# EAGLE design LoraWAN Soil Moisture Sensor v2.0 (EAGLE 6.1)
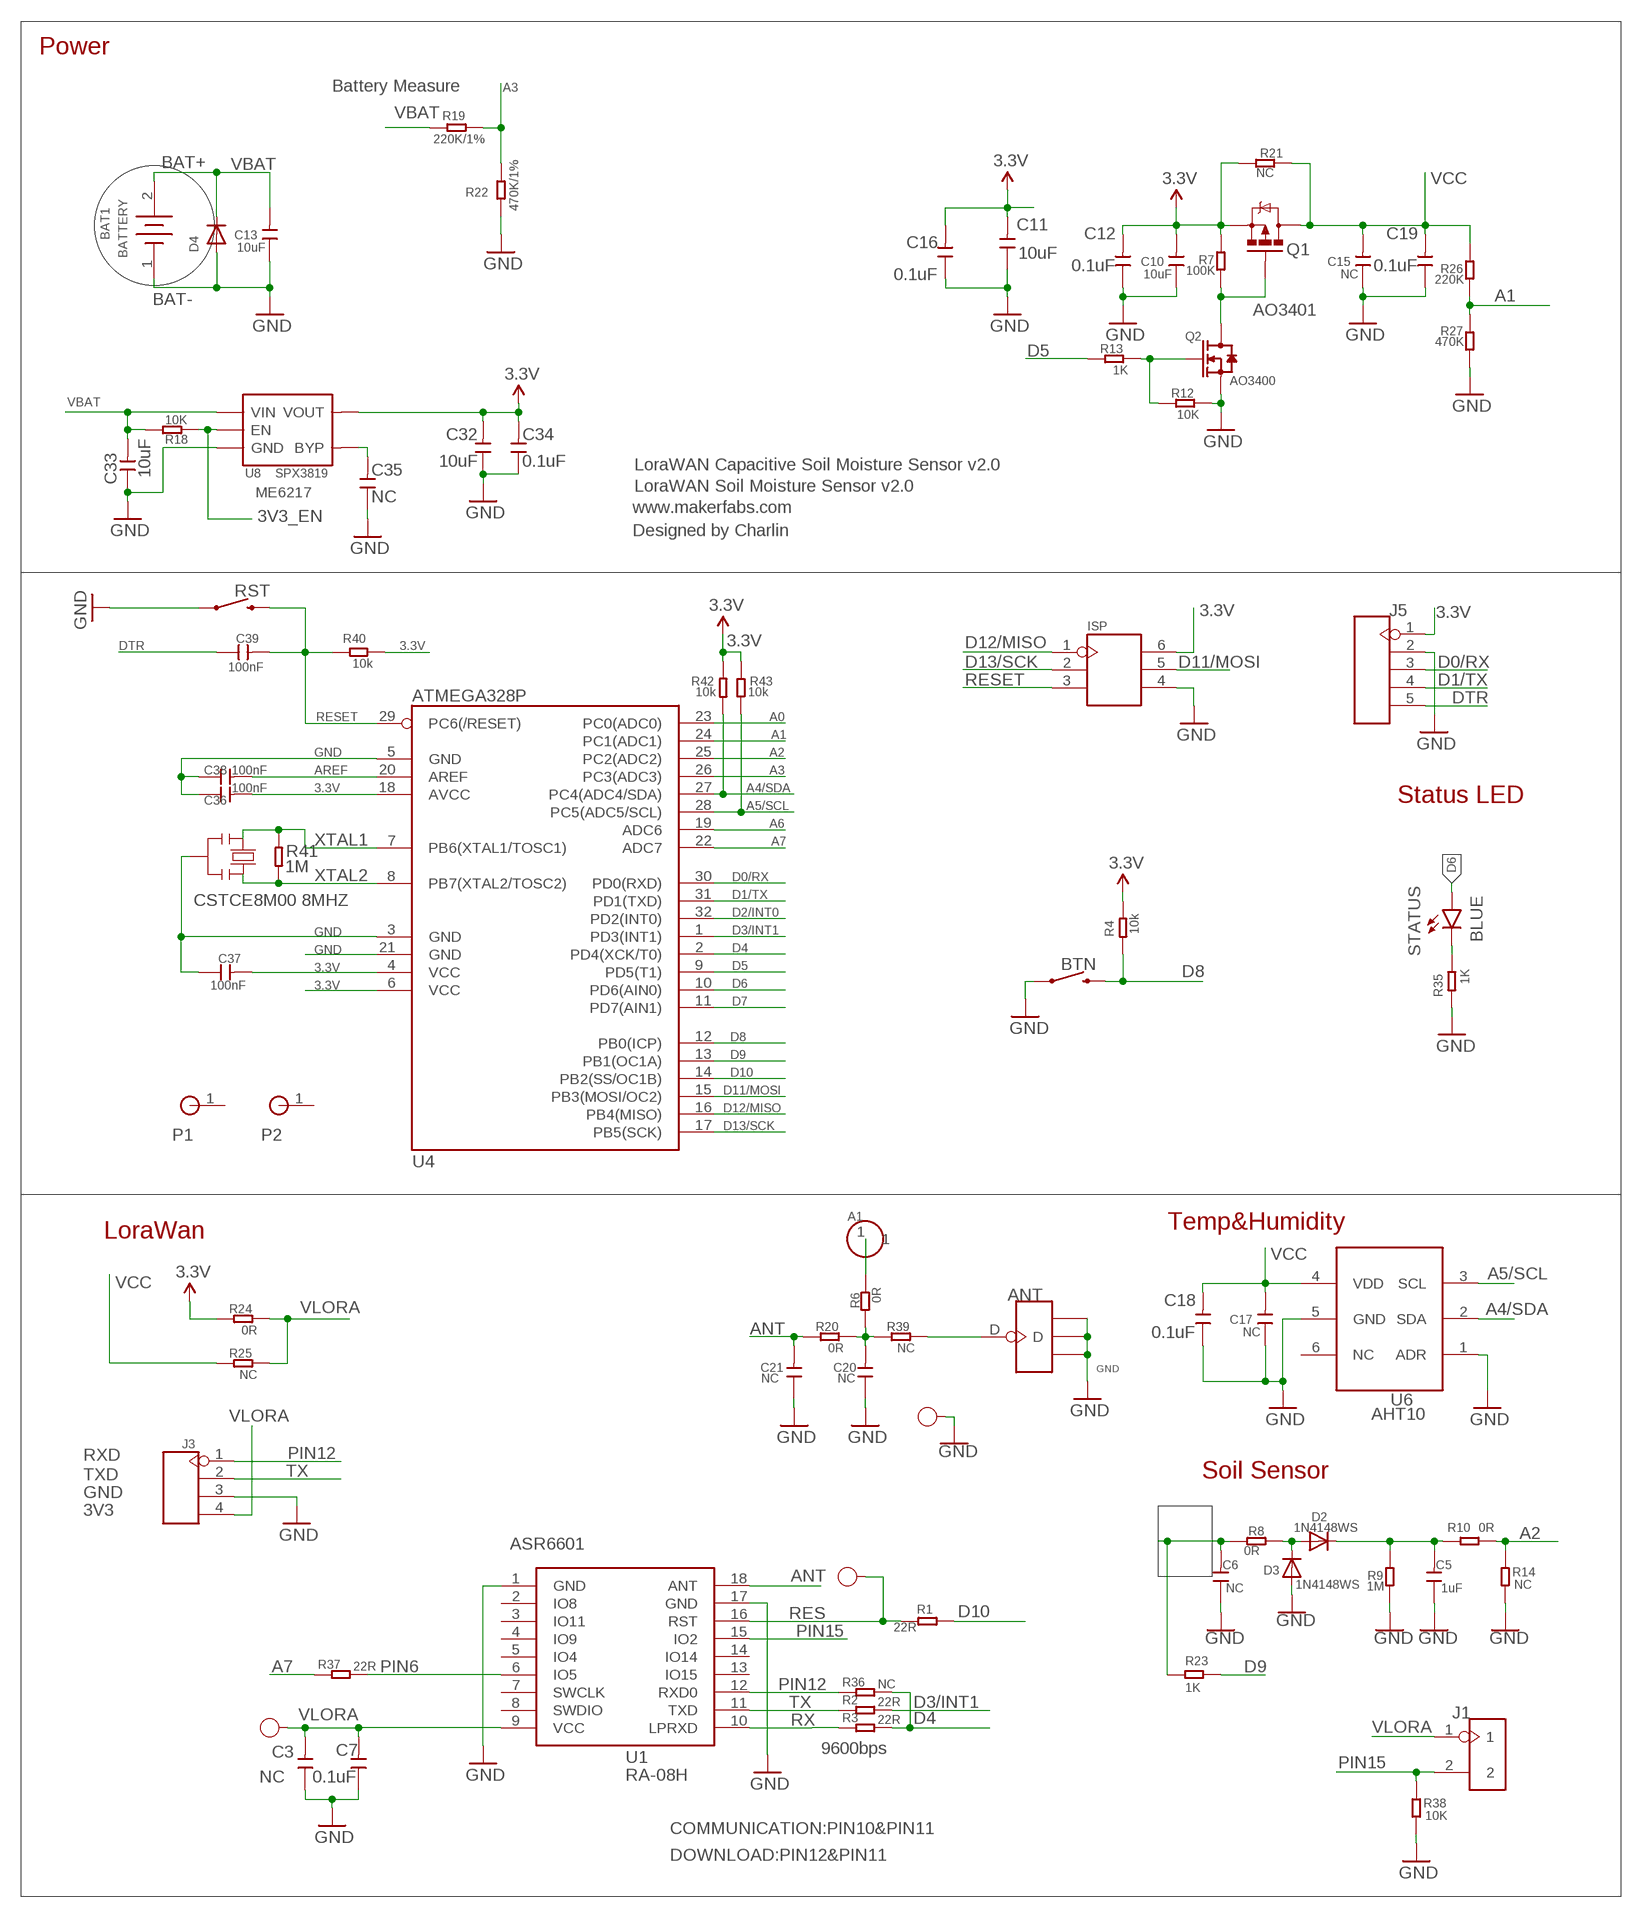
[diagram p0: schematic, sheet 1]

## Parts
3V3  TEST-POINT'4545'  [TP-D45MIL]
A1  HEADER-1P-50  [1P-100/50MIL]
ANT  ANTENNA-U-FL  [4P-U-FL]
BAT1  BATTERY  [BATTERY]
BTN  MOMENTARY-SWITCH-SPST-SMD-6.0X3.5MM  [TACTILE_SWITCH_SMD_6.0X3.5MM]
C3  NC  C-0603  [0603]
C5  1uF  DISCRETE_C-0603  [DISCRETE_C0603]
C6  NC  DISCRETE_C-0603  [DISCRETE_C0603]
C7  0.1uF  C-0603  [0603]
C10  10uF  C-0603  [0603]
C11  10uF  C-0603  [0603]
C12  0.1uF  C-0603  [0603]
C13  10uF  C-0603  [0603]
C15  NC  C-0603  [0603]
C16  0.1uF  C-0603  [0603]
C17  NC  C-0603  [0603]
C18  0.1uF  C-0603  [0603]
C19  0.1uF  C-0603  [0603]
C20  NC  C-0603  [0603]
C21  NC  C-0603  [0603]
C32  10uF  C-0603  [0603]
C33  10uF  C-0603  [0603]
C34  0.1uF  C-0603  [0603]
C35  NC  C-0603  [0603]
C36  100nF  C-0603  [0603]
C37  100nF  C-0603  [0603]
C38  100nF  C-0603  [0603]
C39  100nF  C-0603  [0603]
D2  1N4148WS  DIODESOD-323F  [SOD-323F]
D3  1N4148WS  DIODESOD-323F  [SOD-323F]
D4  DIODESOD-323F  [SOD-323F]
GND  TEST-POINT'4545'  [TP-D45MIL]
ISP  HEADER-2X3P-SMD  [2X3P-2.54-SMD]
J1  HEADER-2P-2.0  [2P-2.0]
J3  HEADER-4P-60/35MILROUND  [4P-65/35ROUND]
J5  HEADER-5P-2.54  [5P-2.54]
P1  HOLE-P1-2.2  [MTGNP1-220-1MM]
P2  HOLE-P1-2.2  [MTGNP1-220-1MM]
Q1  MOSFET-PCHANNEL  [SOT23-3]
Q2  AO3400  DISCRETE_MOSFET-NSOT23  [DISCRETE_SOT23]
R1  22R  R-0603  [R0603]
R2  22R  R-0603  [R0603]
R3  22R  R-0603  [R0603]
R4  10k  R-0603  [R0603]
R6  0R  R-0603  [R0603]
R7  100K  R-0603  [R0603]
R8  0R  R-0603  [R0603]
R9  1M  R-0603  [R0603]
R10  0R  R-0603  [R0603]
R12  10K  R-0603  [R0603]
R13  1K  R-0603  [R0603]
R14  NC  R-0603  [R0603]
R18  10K  R-0603  [R0603]
R19  220K/1%  R-0603  [R0603]
R20  0R  R-0603  [R0603]
R21  NC  R-0603  [R0603]
R22  470K/1%  R-0603  [R0603]
R23  1K  RES-0603  [R0603]
R24  0R  R-0603  [R0603]
R25  NC  R-0603  [R0603]
R26  220K  R-0603  [R0603]
R27  470K  R-0603  [R0603]
R35  1K  R-0603  [R0603]
R36  NC  R-0603  [R0603]
R37  22R  R-0603  [R0603]
R38  10K  R-0603  [R0603]
R39  NC  R-0603  [R0603]
R40  10k  R-0603  [R0603]
R41  1M  R-0603  [R0603]
R42  10k  R-0603  [R0603]
R43  10k  R-0603  [R0603]
RES  TEST-POINT'4545'  [TP-D45MIL]
RST  MOMENTARY-SWITCH-SPST-SMD-6.0X3.5MM  [TACTILE_SWITCH_SMD_6.0X3.5MM]
STATUS  BLUE  LED-BLUE0603  [LED-0603]
U1  RA-08H  [RA-08H]
U4  ATMEGA328P  ATMEGA8/168/328  [TQFP32]
U6  AHT10  [SMD6-127P-400L500W]
U8  SPX3819  [SOT23-5]
Y1  CSTCE8M00 8MHZ  RESONATORMU  [RESONATOR]

## Nets
3.3V: C10.2 C11.2 C12.2 C16.2 C32.2 C34.2 C36.2 C37.2 ISP.6 J5.1 Q1.2(S) R4.1 R7.2 R21.2 R24.2 R40.1 R42.1 R43.1 U4.4(VCC) U4.6(VCC) U4.18(AVCC) U8.5(VOUT)
3V3_EN: R18.2 U8.3(EN)
A0: U4.23(PC0(ADC0))
A1: R26.1 R27.2 U4.24(PC1(ADC1))
A2: R10.2 R14.1 U4.25(PC2(ADC2))
A3: R19.1 R22.2 U4.26(PC3(ADC3))
A4/SDA: R42.2 U4.27(PC4(ADC4/SDA)) U6.2(SDA)
A5/SCL: R43.2 U4.28(PC5(ADC5/SCL)) U6.3(SCL)
A6: U4.19(ADC6)
A7: R37.1 U4.22(ADC7)
ANT: C21.2 R20.2 U1.18(ANT)
AREF: C38.2 U4.20(AREF)
D0/RX: J5.3 U4.30(PD0(RXD))
D1/TX: J5.4 U4.31(PD1(TXD))
D2/INT0: U4.32(PD2(INT0))
D3/INT1: R2.2 U4.1(PD3(INT1))
D4: R3.2 R36.2 U4.2(PD4(XCK/T0))
D5: R13.2 U4.9(PD5(T1))
D6: STATUS.A U4.10(PD6(AIN0))
D7: U4.11(PD7(AIN1))
D8: BTN.2 R4.2 U4.12(PB0(ICP))
D9: R23.2 U4.13(PB1(OC1A))
D10: R1.2 U4.14(PB2(SS/OC1B))
D11/MOSI: ISP.5 U4.15(PB3(MOSI/OC2))
D12/MISO: ISP.1 U4.16(PB4(MISO))
D13/SCK: ISP.2 U4.17(PB5(SCK))
DTR: C39.1 J5.5
GND: ANT.GND1 ANT.GND2 ANT.GND3 BAT1.1 BTN.1 C3.1 C5.1 C6.1 C7.1 C10.1 C11.1 C12.1 C13.1 C15.1 C16.1 C17.1 C18.1 C19.1 C20.1 C21.1 C32.1 C33.1 C34.1 C35.1 C36.1 C37.1 C38.1 D3.A D4.A GND.T ISP.4 J3.3 J5.2 Q2.2(S) R9.1 R12.1 R14.2 R22.1 R27.1 R35.2 R38.2 RST.1 U1.1(GND) U1.17(GND) U4.3(GND) U4.5(GND) U4.21(GND) U6.1(ADR) U6.5(GND) U8.2(GND) Y1.2
N$1: ANT.D R39.1
N$5: C6.2 R8.1 R23.1
N$6: A1.1 R6.1
N$8: Q1.1(G) Q2.3(D) R7.1
N$9: D2.A D3.C R8.2
N$10: Q2.1(G) R12.2 R13.1
N$11: C5.2 D2.C R9.2 R10.1
N$12: C20.2 R6.2 R20.1 R39.2
N$16: C35.2 U8.4(BYP)
N$19: R35.1 STATUS.C
PIN6: R37.2 U1.6(IO5)
PIN12: J3.1 R36.1 U1.12(RXD0)
PIN15: J1.2 R38.1 U1.15(IO2)
RES: R1.1 RES.T U1.16(RST)
RESET: C39.2 ISP.3 R40.2 RST.2 U4.29(PC6(/RESET))
RX: R3.1 U1.10(LPRXD)
TX: J3.2 R2.1 U1.11(TXD)
VBAT: BAT1.2 C13.2 C33.2 D4.C R18.1 R19.2 U8.1(VIN)
VCC: C15.2 C17.2 C18.2 C19.2 Q1.3(D) R21.1 R25.2 R26.2 U6.4(VDD)
VLORA: 3V3.T C3.2 C7.2 J1.1 J3.4 R24.1 R25.1 U1.9(VCC)
XTAL1: R41.2 U4.7(PB6(XTAL1/TOSC1)) Y1.1
XTAL2: R41.1 U4.8(PB7(XTAL2/TOSC2)) Y1.3
Unconnected: P1.1 P2.1 U1.2(IO8) U1.3(IO11) U1.4(IO9) U1.5(IO4) U1.7(SWCLK) U1.8(SWDIO) U1.13(IO15) U1.14(IO14) U6.6(NC)

## Notes on the sheet
- Power
- Battery Measure
- BAT+
- BAT-
- AO3401
- LoraWAN Capacitive Soil Moisture Sensor v2.0
- LoraWAN Soil Moisture Sensor v2.0
- ME6217
- www.makerfabs.com
- Designed by Charlin
- Status LED
- Temp&Humidity
- LoraWan
- RXD
- Soil Sensor
- TXD
- GND
- 3V3
- ASR6601
- 9600bps
- COMMUNICATION:PIN10&PIN11
- DOWNLOAD:PIN12&PIN11

## Library data of the parts
3V3 GND RES = Discrete-new:TEST-POINT; PARTNO: DNP
A1 = Connector:HEADER-1P
ANT = Connector:ANTENNA-U-FL
BAT1 = sale:BATTERY
BTN RST = SparkFun-Switches:MOMENTARY-SWITCH-SPST: Momentary Switch (Pushbutton) - SPST Normally-open (NO) SPST momentary switches (buttons, pushbuttons). Variants PTH-12MM - 12mm square, through-hole Momentary Pushbutton Switch - 12mm Square <https://www.sparkfun.com/products/9190> (COM-09190) PTH-6.0MM, PTH-6.0MM-KIT - 6.0mm square, through-hole Mini Pushbutton Switch <https://www.sparkfun.com/products/97> (COM-00097) KIT package intended for soldering kit's - only one side of pads' copper is exposed. PTH-RIGHT-ANGLE-KIT - Right-angle, through-hole Right Angle Tactile Button <https://www.sparkfun.com/products/10791> - Used on SparkFun BigTime Watch Kit <https://www.sparkfun.com/products/11734> SMD-12MM - 12mm square, surface-mount Tactile Button - SMD (12mm) <https://www.sparkfun.com/products/12993> (COM-12993) Used on SparkFun PicoBoard <https://www.sparkfun.com/products/11888> SMD-4.5MM - 4.5mm Square Trackball Switch Used on SparkFun Blackberry Trackballer Breakout <https://www.sparkfun.com/products/13169> SMD-4.6MMX2.8MM - 4.60mm x 2.80mm, surface mount Used on SparkFun SAMD21 Mini Breakout <https://www.sparkfun.com/products/13664> SMD-5.2MM, SMD-5.2-REDUNDANT - 5.2mm square, surface-mount Mini Pushbutton Switch - SMD <https://www.sparkfun.com/products/8720> (COM-08720) Used on Arduino Pro Mini <https://www.sparkfun.com/products/11114> REDUNDANT package connects both switch circuits together SMD-6.0X3.5MM - 6.0 x 3.5mm, surface mount Momentary Reset Switch SMD <https://www.sparkfun.com/products/8229> (COM-08229) SMD-6.2MM-TALL - 6.2mm square, surface mount Tactile Button - SMD (6mm) <https://www.sparkfun.com/products/12992> Used on SparkFun Digital Sandbox <https://www.sparkfun.com/products/12651> SMD-RIGHT-ANGLE - Right-angle, surface mount Used on SparkFun Block for Intel® Edison - Arduino <https://www.sparkfun.com/products/13036>; PROD_ID: SWCH-00815; SF_SKU: COM-08229
C3 C7 C10-C13 C15-C21 C32-C39 = Discrete:C*: Ceramic Capacitors
C5 C6 = A9G:DISCRETE_C*: Ceramic Capacitors
D2-D4 = adafruit2:DIODE: Diode SMADIODE - SMA Surface Mount Package 20V 1A Schottky Diode Digikey: 641-1014-6-ND DO-1N4148 - Through Hole Small Current Diode SOD-123 20V 1 A (.5mV Vf) Schottky Diode - Digikey: MBRX120TPMSCT-ND SOD-323 10V 570mA (.38mV Vf, 3ns) Schottky Diode - Digikey: ZLLS410CT-ND SOD-523 30V 30mA Schottky Diode (RB751S-40TE61) - Digikey: RB751S-40TE61CT-ND SOT23-R/W - SOT23 Package (R = Solder Paste/Reflow Ovens, W = Hand-Soldering) BAT54Film 40V 300mA - Digikey: 497-7162-1-ND
ISP = Connector:HEADER-2X3P
J1 = Connector:HEADER-2P
J3 = Connector:HEADER-4P
J5 = Connector:HEADER-5P
P1 P2 = self:HOLE-P1-2.2
Q1 = User-Submitted:MOSFET-PCHANNEL: Generic PMOSFET IRLML2244 - TRANS-11153 (SOT-23 -20V -4.3A) (1.Gate 2.Source 3.Drain) FQP27P06 - COM-10349 <http://www.sparkfun.com/products/10349> (TO-220 -60V -27A) (1.Gate 2.Source 3.Drain); PROD_ID: TRANS-08285
Q2 = A9G:DISCRETE_MOSFET-N: IRLL014: http://www.vishay.com/docs/91319/sihll014.pdf
R1-R4 R6-R10 R12-R14 R18-R22 R24-R27 R35-R43 = Discrete:R*
R23 = Discrete-new:RES
STATUS = SparkFun-LED:LED-BLUE: Blue SMD LED Used in manufacturing of various products at SparkFun Packages: 0603 - SMD 0603 package [Product Link] <http://www.digikey.com/product-detail/en/SMLE12BC7TT86/511-1589-2-ND/1641808> 1206 - SMD1206 package [Product Link] <http://www.digikey.com/product-detail/en/lite-on-inc/LTST-C150TBKT/160-1643-1-ND/573584> SparkFun Products: ESP8266 Thing-Dev Board <https://www.sparkfun.com/products/13711> RedBoard <https://www.sparkfun.com/products/12757>; PROD_ID: DIO-08575
U1 = sale:RA-08H
U4 = IC:ATMEGA8/168/328: MICROCONTROLLER
U6 = self:AHT10
U8 = IC:SPX3819
Y1 = SmartPrj:RESONATOR

## Net classes
0 default: width 0.152 mm, drill 0.305 mm, clearance 0.152 mm
2 Clock: width 0.089 mm, clearance 0.178 mm

## Board
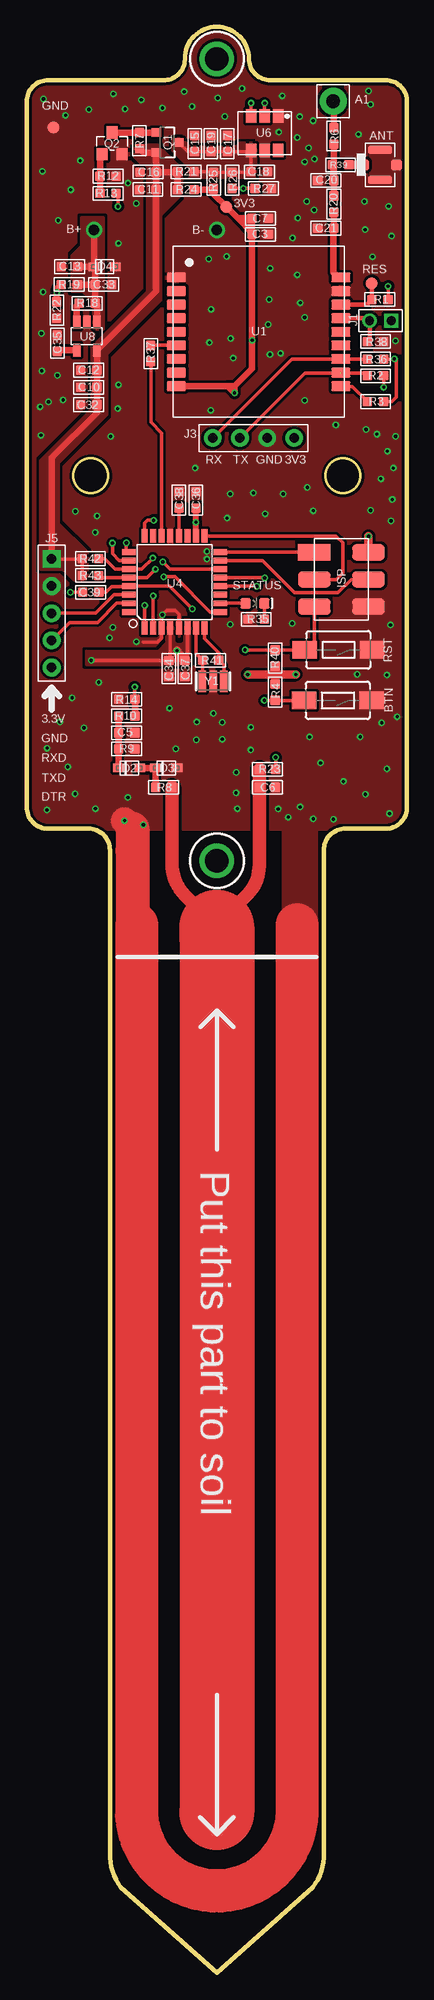
[diagram p1: board, top side]
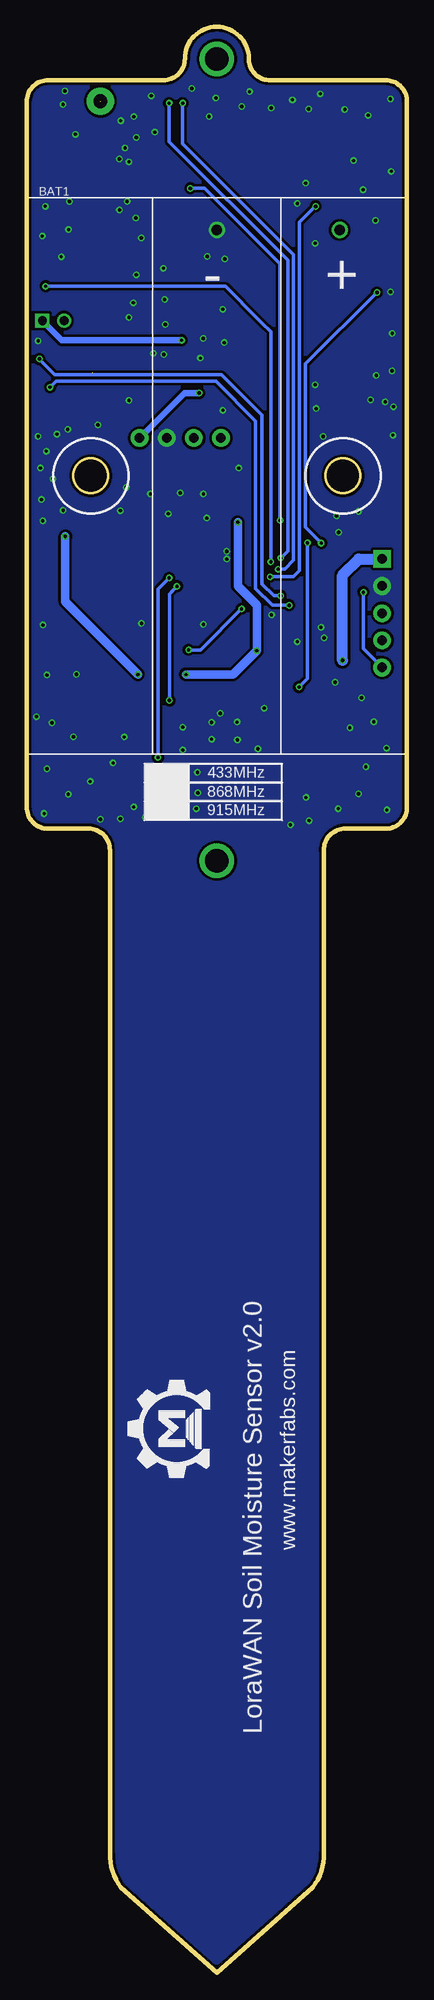
[diagram p2: board, bottom side, seen from below]

Size 35.6 x 182 mm. Coordinates in mm from the lower left corner, seen from the top.
Outline: 17.8,0 8.8,8 arc-38 7.79,11.18 7.79,105 arc90 5.79,107 2,107 arc-90 0,109 0,175 arc-90 2,177 12.8,177 arc90 14.8,178.89 14.8,179 arc-180 20.8,179 arc90 22.8,177 33.6,177 arc-90 35.6,175 35.6,109 arc-90 33.6,107 29.81,107 arc90 27.81,105 27.81,11.18 arc-38 26.8,8 17.8,0
Outline: circle at 6,140 radius 1.6
Outline: circle at 29.6,140 radius 1.6
Copper layers (1*16): Top 0.035mm / dielectric 1.5mm / Bottom 0.035mm
Design rules: minimum track width 8mil, minimum drill 12mil, track to track 6mil, track to pad 6mil, pad to pad 6mil, via to via 6mil, smd to smd 0mil, copper to edge 10mil, drill to drill 10mil, minimum pad ring 10mil, minimum via ring 6mil, stop-mask expansion 4mil, vias tented up to drill 100mil, thermal gap 0mil

### Footprints (pad centres in the part's own frame; a part is rotated, then mirrored left to right if it is on the bottom)
TP-D45MIL = smd 1.143 x 1.143: T 0,0
1P-100/50MIL = drill 1.27 pad 2.54: 1 0,0
4P-U-FL = smd 1.016 x 1.016: D -1.524,0; GND3 1.524,0 | smd 2.286 x 0.762: GND1 0,1.397; GND2 0,-1.397
BATTERY = drill 1: 1 -23,0; 2 -23,11.5
TACTILE_SWITCH_SMD_6.0X3.5MM = smd 2.3 x 1.6: 1 -3.15,0; 2 3.15,0
0603 = smd 0.889 x 0.889: 1 -0.762,0; 2 0.762,0
DISCRETE_C0603 = smd 0.889 x 0.889: 1 -0.762,0; 2 0.762,0
SOD-323F = smd 1 x 0.8: A -1,0; C 1,0
2X3P-2.54-SMD = smd 3.048 x 1.524: 1 -2.54,2.54; 2 -2.54,0; 3 -2.54,-2.54; 4 2.54,-2.54; 5 2.54,0; 6 2.54,2.54
2P-2.0 = drill 0.813 pad 1.27 square: 1 -1.016,0 | drill 0.813 pad 1.27: 2 1.016,0
4P-65/35ROUND = drill 0.889 pad 1.651: 1 0,3.81; 2 0,1.27; 3 0,-1.27; 4 0,-3.81
5P-2.54 = drill 0.889 pad 1.651 square: 1 0,5.08 | drill 0.889 pad 1.651: 2 0,2.54; 3 0,0; 4 0,-2.54; 5 0,-5.08
MTGNP1-220-1MM = drill 2.2: 1 0,0
SOT23-3 = smd 0.8 x 0.9: 1 -0.95,-1; 2 0.95,-1; 3 0,1.1
DISCRETE_SOT23 = smd 1.016 x 1.143: 1 -0.95,-1.016; 2 0.95,-1.016; 3 0,1.016
R0603 = smd 0.889 x 0.889: 1 -0.762,0; 2 0.762,0
R0603' = smd 0.889 x 0.889: 1 0,0.762; 2 0,-0.762
LED-0603 = smd 1 x 1: A -0.877,0; C 0.877,0
RA-08H = smd 1.8 x 0.91: 1 -7.7,5.08; 2 -7.7,3.81; 3 -7.7,2.54; 4 -7.7,1.27; 5 -7.7,0; 6 -7.7,-1.27; 7 -7.7,-2.54; 8 -7.7,-3.81; 9 -7.7,-5.08; 10 7.7,-5.08; 11 7.7,-3.81; 12 7.7,-2.54; 13 7.7,-1.27; 14 7.7,0; 15 7.7,1.27; 16 7.7,2.54; 17 7.7,3.81; 18 7.7,5.08
TQFP32 = smd 1.27 x 0.559: 1 -4.293,2.8; 2 -4.293,2; 3 -4.293,1.2; 4 -4.293,0.4; 5 -4.293,-0.4; 6 -4.293,-1.2; 7 -4.293,-2; 8 -4.293,-2.8; 17 4.293,-2.8; 18 4.293,-2; 19 4.293,-1.2; 20 4.293,-0.4; 21 4.293,0.4; 22 4.293,1.2; 23 4.293,2; 24 4.293,2.8 | smd 0.559 x 1.27: 9 -2.8,-4.293; 10 -2,-4.293; 11 -1.2,-4.293; 12 -0.4,-4.293; 13 0.4,-4.293; 14 1.2,-4.293; 15 2,-4.293; 16 2.8,-4.293; 25 2.8,4.293; 26 2,4.293; 27 1.2,4.293; 28 0.4,4.293; 29 -0.4,4.293; 30 -1.2,4.293; 31 -2,4.293; 32 -2.8,4.293
SMD6-127P-400L500W = smd 1.27 x 1: 1 -1.6,1.27; 2 -1.6,0; 3 -1.6,-1.27; 4 1.6,-1.27; 5 1.6,0; 6 1.6,1.27
SOT23-5 = smd 0.69 x 1.2: 1 -0.95,-1.3; 2 0,-1.3; 3 0.95,-1.3; 4 0.95,1.3; 5 -0.95,1.3
RESONATOR = smd 0.7 x 2: 1 -1,0; 2 0,0; 3 1,0

### Placement (x,y rotation side)
3V3  18.69,165.15 90 top
A1  28.7,175.03 0 top
ANT  33.08,169.09 0 top
BAT1  17.8,140 270 bottom
BTN  29.13,119 180 top
C3  21.86,162.59 180 top
C5  9.36,115.97 180 top
C6  22.54,110.87 180 top
C7  21.86,164.08 180 top
C10  5.81,148.29 0 top
C11  11.34,166.77 0 top
C12  5.81,149.89 0 top
C13  4,159.56 0 top
C15  15.72,171.07 270 top
C16  11.36,168.41 0 top
C17  18.79,171.07 270 top
C18  21.77,168.44 180 top
C19  17.24,171.07 270 top
C20  27.99,167.63 0 top
C21  27.99,163.16 0 top
C32  5.81,146.66 0 top
C33  7.18,157.89 180 top
C34  13.3,121.97 90 top
C35  2.86,152.4 270 top
C36  15.84,137.74 270 top
C37  14.8,121.97 90 top
C38  14.24,137.74 270 top
C39  5.99,129.11 0 top
D2  9.6,112.68 180 top
D3  13.06,112.68 180 top
D4  7.3,159.56 180 top
GND  2.51,172.59 90 top
ISP  29.46,130.3 0 top
J1  33.12,154.51 180 top
J3  21.23,143.54 90 top
J5  2.33,127.15 0 top
P1  17.8,104 0 top
P2  17.8,179 0 top
Q1  13.13,171.17 270 top
Q2  8,171.09 0 top
R1  33.07,156.49 0 top
R2  32.66,149.35 0 top
R3  32.66,146.94 0 top
R4  23.26,119.76 270 top
R6  28.75,171.78 270 top
R7  10.56,171.35 270 top
R8  12.82,110.87 180 top
R9  9.36,114.45 180 top
R10  9.36,117.55 0 top
R12  7.61,168.02 180 top
R13  7.61,166.42 0 top
R14  9.36,119.11 180 top
R18  5.66,156.13 180 top
R19  3.98,157.89 0 top
R20  28.76,165.41 270 top
R21  14.9,168.43 180 top
R22  2.81,155.5 90 top
R23  1K  [R0603']  22.55,112.55 90 top
R24  14.9,166.77 180 top
R25  17.5,167.64 90 top
R26  19.22,167.64 90 top
R27  22.14,166.88 180 top
R35  21.48,126.59 180 top
R36  32.66,150.93 0 top
R37  11.6,151.43 90 top
R38  32.66,152.55 0 top
R39  29.38,169.09 180 top
R40  23.26,122.96 90 top
R41  17.22,122.76 180 top
R42  5.96,132.26 0 top
R43  5.96,130.68 0 top
RES  32.3,158.01 90 top
RST  29.18,123.72 180 top
STATUS  21.36,128.07 0 top
U1  21.71,153.47 0 top
U4  13.84,130.07 90 top
U6  22.27,172.04 270 top
U8  5.63,153.06 180 top
U$7  [MAKERFABS_0.3]  18.5,46.76 90 bottom
Y1  17.44,120.78 0 top

### Tracks (layer width: path | path; a pad name or v marks a point on that pad's centre or on a via)
3.3V  (via drill 0.3)
  Top 0.305: J5.1 5.23,132.23 5.23,132.28 | R43.1 R42.1 | C36.2 | C34.2 v6.04,122.73 | U4.4 13.44,122.87 C34.2 | U4.6 15.04,122.97 C37.2 C34.2 | U4.18 v15.84,135.66
  Top 0.546: U4.18 C36.2
  Top 0.61: J5.1 2.33,141.68 6.57,145.92 C32.2 C10.2 C12.2 6.58,149.9 U8.5 12.1,157.28 C11.2 12.12,166.79 C16.2 | R7.2 10.93,170.22 Q1.2 C16.2 | C16.2 14.13,168.41 R21.2 R24.2
  Top 0.813: R4.1 23.26,121.44 | 23.26,121.44 R40.1 | v32,134.34 ISP.6 | C37.2 14.07,123.47 v14.07,123.65 | v20.7,121.41 v25.19,121.41 23.29,121.41 23.26,121.44
  Bottom 0.305: 3.91,132.23 J5.1
  Bottom 0.813: v15.84,135.66 15.84,129.69 14.07,127.91 v14.07,123.65 16.3,121.41 v20.7,121.41 | v25.19,121.41 32,128.22 v32,134.34
  Bottom 1.016: v6.04,122.73 6.04,130.71 4.52,132.23 J5.1
  pour Top: 10.08,170.92 12.26,170.92 14.5,168.68 14.5,166.32 12.54,164.36 12.54,156.44 7.49,151.38 7.49,145.72 2.97,141.2 2.97,135.53 5.66,132.84 5.66,130.3 4.39,130.3 3.4,131.29 1.29,131.29 1.29,141.4 6.12,146.23 6.12,152.04 11.3,157.23 11.3,168.66 10.15,169.8 10.08,169.88
  pour Top: 13.15,126.49 13.15,124.38 12.34,123.57 5.63,123.57 5.61,123.6 5.61,122.35 15.23,122.35 15.23,126.52 14.8,126.52 14.8,124.51 14.52,124.23 14.02,124.23 13.74,124.51 13.74,126.49
3V3_EN
  Top 0.61: U8.3 4.68,155.92 R18.2
A1  (via drill 0.3)
  Top 0.305: U4.24 11.04,135.58 11.3,135.84 v11.88,135.84 | R27.2 v20.29,166.88 R26.1
  Bottom 0.305: v20.29,166.88 18.94,166.88 11.88,159.82 v11.88,135.84
A2  (via drill 0.3)
  Top 0.305: v10.1,120.24 10.1,119.13 R14.1 | U4.25 9.32,133.1 v9.32,133.73
  Top 0.61: R10.2 R14.1 | R14.1
  Bottom 0.305: 9.54,120.8 v10.1,120.24 9.32,121.03 v9.32,133.73
A3  (via drill 0.3 pad 0.3)
  Top 0.305: U4.26 8.66,132.07 8.02,132.72 v8.02,133.71
  Top 0.61: R22.2 v2.81,157.15 2.81,157.48 R19.1
  Bottom 0.305: v8.02,133.71 9.49,135.18 9.49,150.47 v2.81,157.15
A4/SDA  (via drill 0.3)
  Top 0.305: R42.2 7.28,132.26 8.27,131.27 U4.27 10.77,131.27 v11.81,132.31 | U6.2 v22.27,174.85
  Bottom 0.305: v22.27,174.85 22.27,171.25 11.17,160.15 11.17,132.94 v11.81,132.31
A5/SCL  (via drill 0.3)
  Top 0.305: R43.2 6.73,130.47 U4.28 11.27,130.48 v12.06,131.27 | U6.3 v21,174.85
  Bottom 0.305: v21,174.85 21,171.07 10.61,160.68 10.61,132.1 11.45,131.27 v12.06,131.27
A7
  Top 0.305: U4.22 12.64,144 11.63,145.01 11.63,150.65 R37.1
ANT
  Top 0.61: R20.2 C21.2 28.72,163.16 28.72,158.98 28.75,158.98 29.18,158.55 U1.18 | U1.18 29.43,158.55 29.54,158.65 29.46,158.65 29.38,158.57 29.39,158.57 U1.18
AREF
  Top 0.305: U4.20 C38.2
D0/RX
  Top 0.305: U4.30 8.19,128.87 6.47,127.15 J5.3
D1/TX
  Top 0.305: U4.31 8.43,128.07 6.65,126.29 4.01,126.29 J5.4
D3/INT1  (via drill 0.3)
  Top 0.305: R2.2 v33.42,148.28 | v11.04,127.89 U4.1
  Bottom 0.305: v11.04,127.89 12.59,127.89 14.17,129.46 14.17,145.14 17.88,148.84 32.86,148.84 v33.42,148.28
D4  (via drill 0.3)
  Top 0.305: R36.2 v34.41,150.93 34.59,150.75 34.59,147.37 34.16,146.94 R3.2 | U4.2 v11.84,128.77 v11.83,128.78
  Bottom 0.305: v34.41,150.93 32.96,149.48 17.37,149.48 14.61,146.72 14.45,146.56 13.58,145.69 13.58,129.9 12.47,128.78 v11.83,128.78
D5  (via drill 0.3)
  Top 0.305: U4.9 17.17,127.27 13.89,130.56 v12.82,130.56 | R13.2 8.55,166.24 v8.55,165.2
  Bottom 0.305: v12.82,130.56 10.61,130.56 10.05,131.12 10.05,163.7 v8.55,165.2
D6
  Top 0.305: U4.10 STATUS.A
D8  (via drill 0.3)
  Top 0.305: BTN.2 R4.2 v22.25,119 | U4.12 v21.53,129.67
  Bottom 0.305: 22.04,129.16 v21.53,129.67 22.25,128.96 v22.25,119
D9  (via drill 0.3)
  Top 0.305: U4.13 22.25,130.47 v22.27,130.45 | v23.31,113.67 v23.31,113.66 R23.2
  Bottom 0.305: v22.27,130.45 23.31,129.41 v23.31,113.67
D10  (via drill 0.3)
  Top 0.305: v33.83,157.73 R1.2 | U4.14 13.43,131.27 v12.75,131.95
  Bottom 0.305: v33.83,157.73 17.01,157.73 13.9,154.62 13.61,154.33 12.75,153.47 v12.75,131.95
D11/MOSI
  Top 0.305: U4.15 22.05,132.07 25.06,129.06 29.13,129.06 30.37,130.3 ISP.5
D12/MISO
  Top 0.305: U4.16 26.89,132.87 ISP.1
D13/SCK
  Top 0.305: U4.17 28.95,134.37 29.59,133.73 29.59,130.89 29,130.3 ISP.2
DTR  (via drill 0.3)
  Top 0.305: v4.08,129.11 C39.1
  Bottom 0.305: J5.5 4.08,123.83 v4.08,129.11
GND  (via drill 0.3 pad 0.15)
  Top 0.305: 10.89,124.46 12.26,124.46 12.64,124.83 U4.3 12.64,126.94 12.7,127 | U4.5 14.24,127.08 13.91,127.41 13.08,127.41 v12.68,127.01
  Top 2.54: v9.15,107.75 9.9,107.01 | 10.3,98 9.9,98.4 9.9,104.93
  Top 3.2: 9.9,107.01 9.9,104.93 9.9,96.5
  Top 4: 10.3,98 10.3,15.03 arc178 25.3,15.03 25.3,98
  other vias: 15.87,115.31 6.44,108.87 19.59,110.34 23.53,108.85 28.71,107.88 7.86,143.69 19.62,112.28 24.85,126.19 6.59,136.25 17.23,146.13 17.48,117.79 26.02,169.37 19.34,151.01 18.7,160.51 19.08,152.84 8.11,175.72 25.38,164.12 23.94,175.55 17.1,152.46 20.15,176.23 31.05,171.94 25.33,171.63 24.88,162.24 32.19,174.73 26.81,173.21 26.4,170.67 26.93,169.63 32.01,176 31.68,163.02 26.2,165.67 26.02,154.82 1.25,146.46 32.19,136.76 26.83,136.74 5.83,174.25 25.56,173.59 17.05,160.28 18.75,136.05 4.12,166.76 15.91,116.97 18.3,116.95 10.27,124.49 30.95,121.44 19.06,126.12 4.53,110.27 6.41,134.7 26.83,107.93 25.59,109.02 31.23,115.6 19.72,108.87 9.46,109.91 18.3,115.37 10.91,107.37 24.49,108.08 26.02,147.05 22.62,154.16 17.26,155.58 25.33,158.81 22.79,159.42 23.76,151.47 14.74,175.93 31.61,165.67 26.91,164.85 22.69,156.5 22.34,136.46 25.61,156.19 32.37,160.48 33.16,139.73 1.89,108.74 34.22,137.78 1.48,168.49 3.64,173.72 10.73,175.17 9.2,174.3 15.48,174.53 5.01,169.48 1.56,175.24 24.01,138.31 1.38,153.32 4.56,136.68 1.53,157.21 34.32,140.72 32.78,143.9 28.94,144.76 34.1,135.8 34.68,117.48 34.53,143.69 2.04,146.92 5.34,116.44 1.91,114.54 3.84,112.78 13.95,114.46 20.99,114.36 20.99,116.49 26.48,115.58 31.71,110.22 29.65,111.41 33.23,116.9 21.22,138.41 33.77,142.3 31.76,144.33 2.96,163.89 3.11,117 7.76,124.85 6.74,120.68 4.25,119.23 8.06,125.84 16.87,132.93 15.76,140.72 19.06,138.31 26.27,138.92 22.77,151.37 34.53,152.61 23.61,172.14 18.53,173.62 17.89,175.34 12.71,174.4 9.48,167.37 10.27,165.46 8.59,161.75 33.87,165.21 34.15,162.41 2.88,149.38 3.41,147.1 1.33,143.8 1.41,149.82 13.37,118.27 16.87,132.21 34.07,126.04 33.72,121.37 33.72,112.61 33.97,108.41 27.52,113.14 8.59,148.52 8.52,146.29
  pour Top (isolate 0.254, rank 6): -7.6,200 -8.16,107 40.61,107 41.17,200
  pour Bottom (isolate 0.254, rank 6): -8.19,200 -8.11,0 40.65,0 40.58,200
  pour Top: 27.05,107.21 27.17,107.21 27.17,93.55 23.44,93.55 23.44,98.09 24,98.65 24,106.91 24,107.21
N$1
  Top 0.813: R39.1 ANT.D
N$5
  Top 1.27: R8.1 13.58,103.76 arc45 14.83,100.76 17.8,97.79 17.8,97.51 | 17.8,96.85 17.8,98 20.66,100.86 arc45 21.77,103.54 C6.2 21.77,112.54 R23.1
  Top 7: 17.8,97.8 17.8,97.51 17.8,96.85 17.8,15
N$6  (1 unrouted)
  Top 0.61: R6.1 28.75,175.01 28.72,175.03
N$8
  Top 0.61: Q2.3 R7.1 12.12,172.11 Q1.1
N$9
  Top 0.61: R8.2 D3.C D2.A
N$10
  Top 0.61: Q2.1 6.85,169.88 R12.2 R13.1
N$11
  Top 0.61: D2.C R9.2 C5.2 R10.1 | R10.1
N$12
  Top 0.406: R39.2 28.62,167.76 C20.2
  Top 0.61: R20.1 C20.2 28.75,169.09 R6.2 28.77,170.8
N$16
  Top 0.61: U8.4 2.99,151.76 C35.2
N$19
  Top 0.305: R35.1 22.25,128.06 STATUS.C
PIN6
  Top 0.305: U1.6 R37.2
PIN12
  Top 0.305: R36.1 U1.12 24.81,150.93 J3.1
PIN15
  Top 0.406: U1.15 31.87,154.74 J1.2 32.1,152.76 R38.1
RES
  Top 0.406: U1.16 31.82,156.01 R1.1 RES.T
RESET  (via drill 0.3)
  Top 0.305: C39.2 7.41,129.11 7.95,129.64 9.51,129.64 U4.29 13.37,129.67 v15.49,127.56 | ISP.3 26.92,124.61 RST.2 R40.2 v20.44,123.72
  Bottom 0.305: v15.49,127.56 19.32,123.72 v20.44,123.72
RX
  Top 0.305: R3.1 31.9,146.96 30.5,148.36 29.44,148.36 U1.10
TX  (1 unrouted)
  Top 0.305: J3.2 26.03,149.61 29.41,149.61 | 29.41,149.61 29.43,149.63 | 29.41,149.61 31.64,149.61 R2.1
VBAT
  Top 0.61: BAT1.2 D4.C | C33.2 6.42,159.43 D4.C | C13.2 D4.C | R19.2 C33.2 | C33.2 R18.1 6.58,155.97 U8.1
  pour Top: 6.24,153.72 6.24,156.26 5.23,157.28 4.26,157.28 4.26,160.6 5.13,161.47 5.13,164.16 7.16,164.16 7.16,153.77 7.16,153.72
VCC
  Top 0.305: Q1.3 15.09,170.31 C15.2 C19.2 C17.2 20.87,170.3 U6.4 C18.2 20.97,168.4 R26.2 R25.2 17.47,168.43 R21.1
  pour Top: 21.43,171.09 21.43,167.94 15.21,167.94 15.21,168.91 13.71,170.41 13.71,171.53 14.5,171.53 15.29,170.74 19.58,170.74 19.96,171.12 21.43,171.12
VLORA  (via drill 0.3 pad 0.15, 0.3 pad 0.3)
  Top 0.61: U1.9 18.82,148.39 | 18.82,148.39 19.45,148.39 | 19.45,148.39 21.1,150.04 v21.1,152.68 C3.2 | C3.2 21.1,162.74 19.76,164.08 | 17.5,166.34 3V3.T 19.76,164.08 | 17.5,166.34 R25.1 | R24.1 17.07,166.77 17.5,166.34 | C7.2 20.59,164.08 | 20.59,164.08 19.76,164.08 | C3.2 21.1,163.58 20.59,164.08 | v19.45,147.75 19.45,148.39 | 18.82,148.39 v19.45,147.75 | v19.45,147.75 19.38,147.83 19.38,148.08
  Bottom 0.61: J1.1 32.3,152.68 v21.1,152.68 | J3.4 20.82,147.75 v19.45,147.75
XTAL1
  Top 0.305: U4.7 15.84,123.37 R41.2 16.45,120.79 Y1.1
XTAL2
  Top 0.305: U4.8 16.64,124.76 17.98,123.42 R41.1 18.44,122.29 Y1.3

### Text on the board
tPlace: B+ | B- | RX | TX | GND | 3V3 | 3.3V | GND | RXD | TXD | DTR | Put this part to soil
bPlace: 433MHz | 868MHz | 915MHz | www.makerfabs.com | LoraWAN Soil Moisture Sensor v2.0